# Altium schematic sheet Sheet2_Inverter_GateDriver.SchDoc
size B; CompanyName: Microchip Technology Inc.; Organization: Microchip Technology; Address1: 2355 West Chandler Blvd.; Address2: Chandler, AZ  85224; Address4: USA; DocumentNumber: 2; SheetNumber: 2; SheetTotal: 5; SheetTitle: Motor Control Inverter; Time: Time
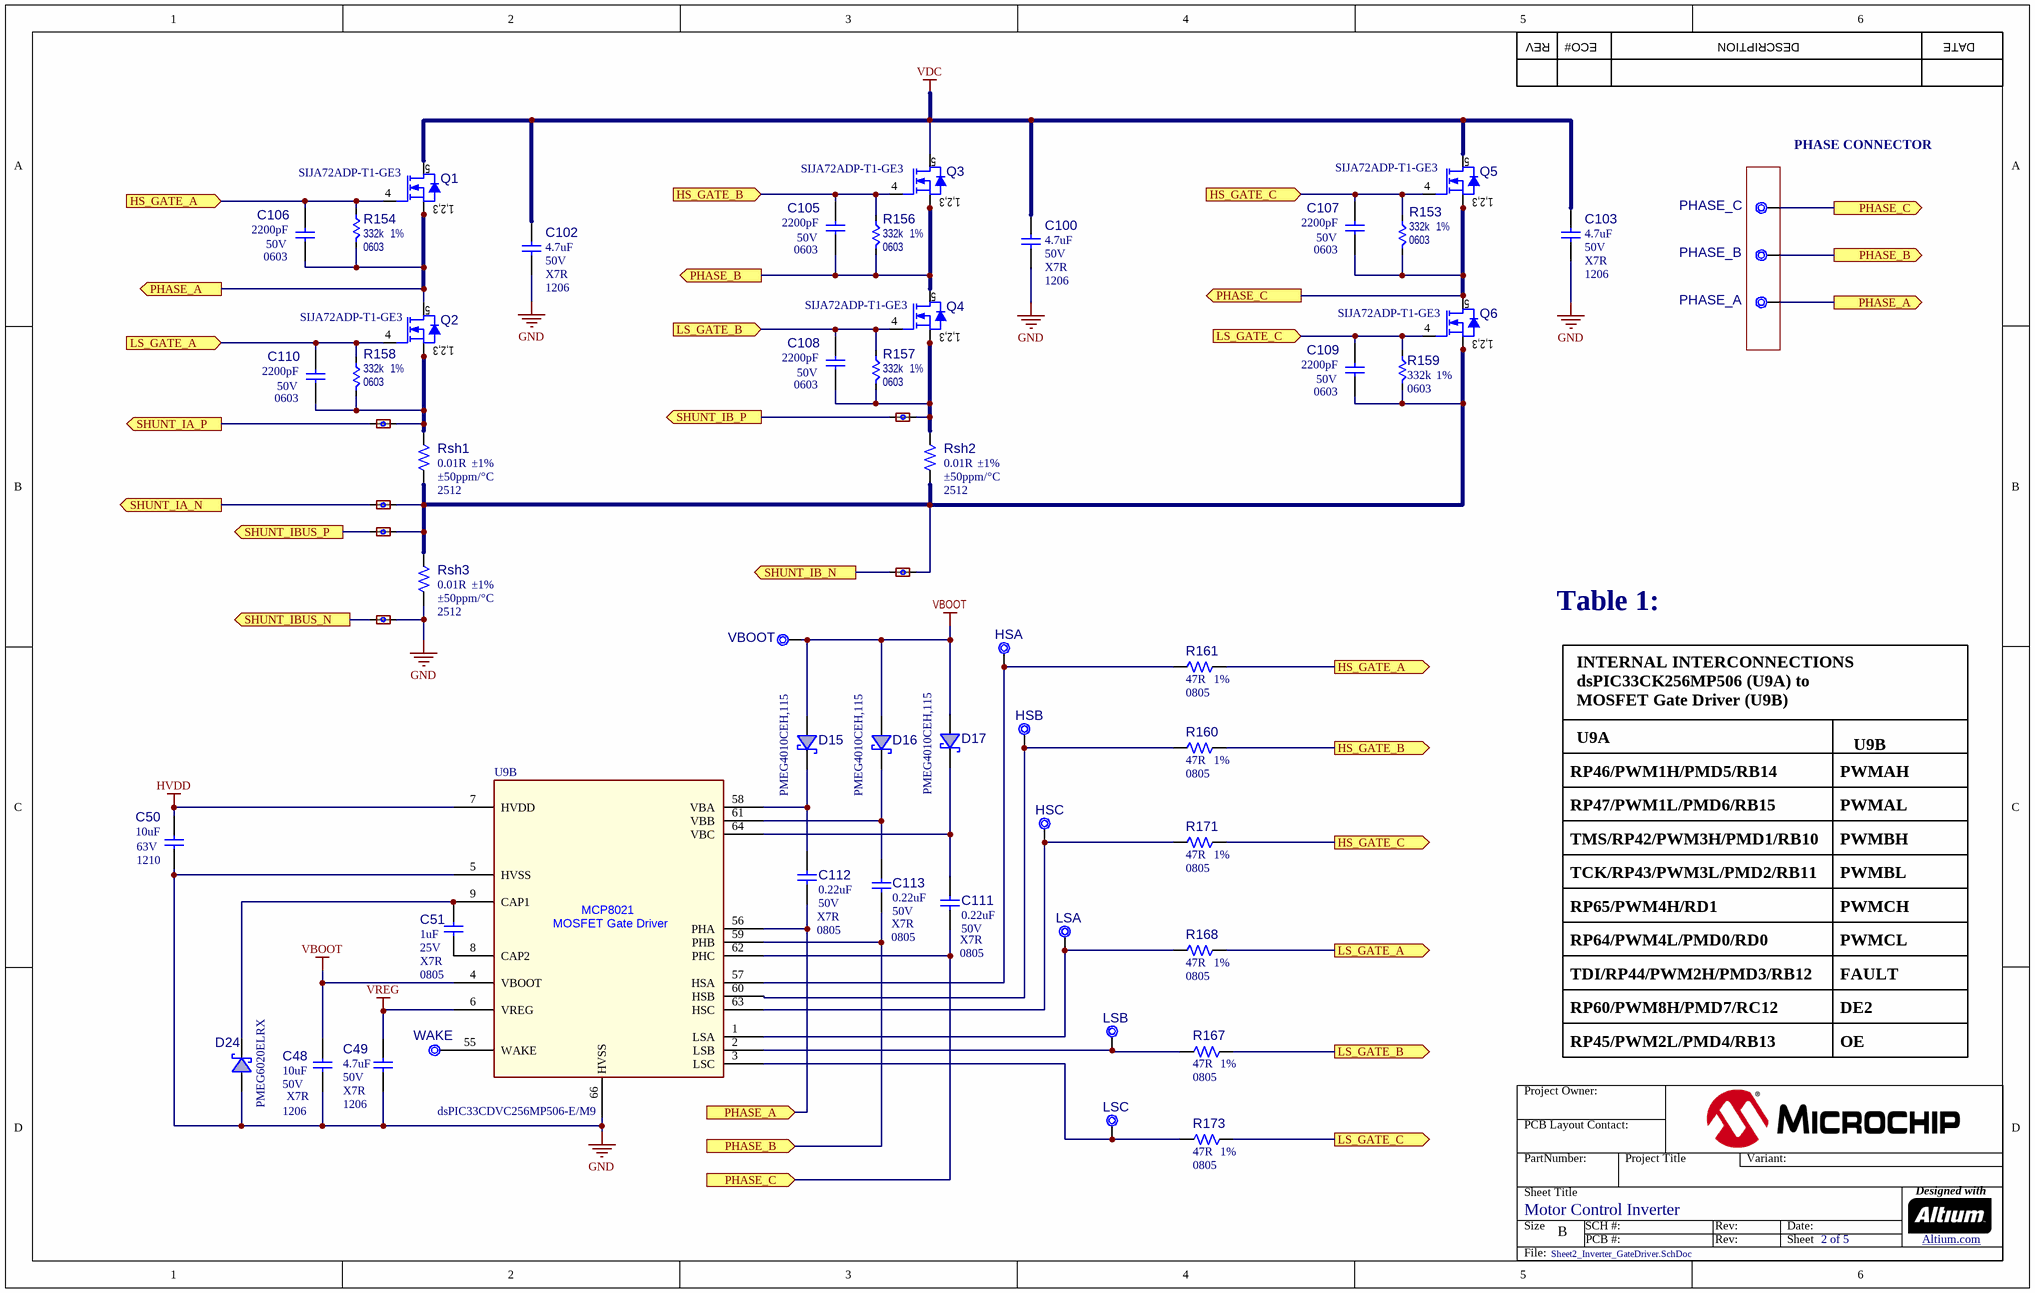
[diagram p0: Sheet2_Inverter_GateDriver.SchDoc]

## Parts
C48  value 10uF  Voltage: 50V  Package: 1206  Temperature Coefficient: X7R  [CAP_C_1206]  (hidden comment: Capacitor NP)
C49  value 4.7uF  Voltage: 50V  Package: 1206  Temperature Coeffcient: X7R  [CAP_C_1206]  (hidden comment: Capacitor NP)
C50  value 10uF  Voltage: 63V  Package: 1210  [CAP_C_1210]  (hidden comment: Capacitor NP)
C51  value 1uF  Voltage: 25V  Package: 0805  Temperature Coeffcient: X7R  [CAP_C_0805]  (hidden comment: Capacitor NP)
C100  value 4.7uF  Voltage: 50V  Package: 1206  Temperature Coeffcient: X7R  [CAP_C_1206]  (hidden comment: Capacitor NP)
C102  value 4.7uF  Voltage: 50V  Package: 1206  Temperature Coeffcient: X7R  [CAP_C_1206]  (hidden comment: Capacitor NP)
C103  value 4.7uF  Voltage: 50V  Package: 1206  Temperature Coeffcient: X7R  [CAP_C_1206]  (hidden comment: Capacitor NP)
C105  value 2200pF  Voltage: 50V  Package: 0603  [CAP_C_0603]  (hidden comment: Capacitor NP)
C106  value 2200pF  Voltage: 50V  Package: 0603  [CAP_C_0603]  (hidden comment: Capacitor NP)
C107  value 2200pF  Voltage: 50V  Package: 0603  [CAP_C_0603]  (hidden comment: Capacitor NP)
C108  value 2200pF  Voltage: 50V  Package: 0603  [CAP_C_0603]  (hidden comment: Capacitor NP)
C109  value 2200pF  Voltage: 50V  Package: 0603  [CAP_C_0603]  (hidden comment: Capacitor NP)
C110  value 2200pF  Voltage: 50V  Package: 0603  [CAP_C_0603]  (hidden comment: Capacitor NP)
C111  value 0.22uF  Voltage: 50V  Package: 0805  Temperature Coeffcient: X7R  [CAP_C_0805]  (hidden comment: Capacitor NP)
C112  value 0.22uF  Voltage: 50V  Package: 0805  Temperature Coeffcient: X7R  [CAP_C_0805]  (hidden comment: Capacitor NP)
C113  value 0.22uF  Voltage: 50V  Package: 0805  Temperature Coeffcient: X7R  [CAP_C_0805]  (hidden comment: Capacitor NP)
D15  value PMEG4010CEH,115  [SOD-123]  (hidden comment: Diode Schottky)
D16  value PMEG4010CEH,115  [SOD-123]  (hidden comment: Diode Schottky)
D17  value PMEG4010CEH,115  [SOD-123]  (hidden comment: Diode Schottky)
D24  value PMEG6020ELRX  [SOD-123W]  (hidden comment: Diode Schottky)
HSA  Test Point No BOM  [TP_TH_0.7PADX0.4HOLE]  (value not drawn)  (no BOM)
HSB  Test Point No BOM  [TP_TH_0.7PADX0.4HOLE]  (value not drawn)  (no BOM)
HSC  Test Point No BOM  [TP_TH_0.7PADX0.4HOLE]  (value not drawn)  (no BOM)
LSA  Test Point No BOM  [TP_TH_0.7PADX0.4HOLE]  (value not drawn)  (no BOM)
LSB  Test Point No BOM  [TP_TH_0.7PADX0.4HOLE]  (value not drawn)  (no BOM)
LSC  Test Point No BOM  [TP_TH_0.7PADX0.4HOLE]  (value not drawn)  (no BOM)
NT1  Net Tie  [NET_TIE_0.2mmx0.5mm]  (value not drawn)  (net tie, no BOM)
NT2  Net Tie  [NET_TIE_0.2mmx0.5mm]  (value not drawn)  (net tie, no BOM)
NT3  Net Tie  [NET_TIE_0.2mmx0.5mm]  (value not drawn)  (net tie, no BOM)
NT4  Net Tie  [NET_TIE_0.2mmx0.5mm]  (value not drawn)  (net tie, no BOM)
NT5  Net Tie  [NET_TIE_0.2mmx0.5mm]  (value not drawn)  (net tie, no BOM)
NT6  Net Tie  [NET_TIE_0.2mmx0.5mm]  (value not drawn)  (net tie, no BOM)
PHASE_A  Test Point No BOM  [TP_3.0X2.3X1.3HOLE]  (value not drawn)  (no BOM)
PHASE_B  Test Point No BOM  [TP_3.0X2.3X1.3HOLE]  (value not drawn)  (no BOM)
PHASE_C  Test Point No BOM  [TP_3.0X2.3X1.3HOLE]  (value not drawn)  (no BOM)
Q1  value SIJA72ADP-T1-GE3  [PPAK_SO-8L]  (hidden comment: Transistor MOS-N SSSGD)
Q2  value SIJA72ADP-T1-GE3  [PPAK_SO-8L]  (hidden comment: Transistor MOS-N SSSGD)
Q3  value SIJA72ADP-T1-GE3  [PPAK_SO-8L]  (hidden comment: Transistor MOS-N SSSGD)
Q4  value SIJA72ADP-T1-GE3  [PPAK_SO-8L]  (hidden comment: Transistor MOS-N SSSGD)
Q5  value SIJA72ADP-T1-GE3  [PPAK_SO-8L]  (hidden comment: Transistor MOS-N SSSGD)
Q6  value SIJA72ADP-T1-GE3  [PPAK_SO-8L]  (hidden comment: Transistor MOS-N SSSGD)
R153  value 332k  Package: 0603  Tolerance: 1%  [RES_C_0603]  (hidden comment: Resistor)
R154  value 332k  Package: 0603  Tolerance: 1%  [RES_C_0603]  (hidden comment: Resistor)
R156  value 332k  Package: 0603  Tolerance: 1%  [RES_C_0603]  (hidden comment: Resistor)
R157  value 332k  Package: 0603  Tolerance: 1%  [RES_C_0603]  (hidden comment: Resistor)
R158  value 332k  Package: 0603  Tolerance: 1%  [RES_C_0603]  (hidden comment: Resistor)
R159  value 332k  Package: 0603  Tolerance: 1%  [RES_C_0603]  (hidden comment: Resistor)
R160  value 47R  Package: 0805  Tolerance: 1%  [RES_C_0805]  (hidden comment: Resistor)
R161  value 47R  Package: 0805  Tolerance: 1%  [RES_C_0805]  (hidden comment: Resistor)
R167  value 47R  Package: 0805  Tolerance: 1%  [RES_C_0805]  (hidden comment: Resistor)
R168  value 47R  Package: 0805  Tolerance: 1%  [RES_C_0805]  (hidden comment: Resistor)
R171  value 47R  Package: 0805  Tolerance: 1%  [RES_C_0805]  (hidden comment: Resistor)
R173  value 47R  Package: 0805  Tolerance: 1%  [RES_C_0805]  (hidden comment: Resistor)
Rsh1  value 0.01R  Package: 2512  Tolerance: ±1%  Temperature Coeffcient: ±50ppm/°C  [RES_C_2512]  (hidden comment: Resistor)
Rsh2  value 0.01R  Package: 2512  Tolerance: ±1%  Temperature Coeffcient: ±50ppm/°C  [RES_C_2512]  (hidden comment: Resistor)
Rsh3  value 0.01R  Package: 2512  Tolerance: ±1%  Temperature Coeffcient: ±50ppm/°C  [RES_C_2512]  (hidden comment: Resistor)
U9  value dsPIC33CDVC256MP506-E/M9  [QFN-64_9X9_3EP_M9]  (hidden comment: dsPIC33CDVC256MP506_VGQFN-64)  (part B of 3)
VBOOT  Test Point No BOM  [TP_TH_0.7PADX0.4HOLE]  (value not drawn)  (no BOM)
WAKE  Test Point No BOM  [CON_TP_SMD_D25mil_NoSilk]  (value not drawn)  (no BOM)

## Ports
HS_GATE_A (in), HS_GATE_A (out), HS_GATE_B (in), HS_GATE_B (out), HS_GATE_C (in), HS_GATE_C (out), LS_GATE_A (in), LS_GATE_A (out), LS_GATE_B (in), LS_GATE_B (out), LS_GATE_C (in), LS_GATE_C (out), PHASE_A (in), PHASE_A (out), PHASE_B (in), PHASE_B (out), PHASE_C (in), PHASE_C (out), SHUNT_IA_N (out), SHUNT_IA_P (out), SHUNT_IB_N (out), SHUNT_IB_P (out), SHUNT_IBUS_N (out), SHUNT_IBUS_P (out)

## Nets
GND: C48.2 C49.2 C50.1 C100.2 C102.2 C103.2 D24.1(A) NT6.2 Rsh3.1 U9.5(HVSS) U9.66(HVSS)
HVDD: C50.2 U9.7(HVDD)
VBOOT: C48.1 D15.1(A) D16.1(A) D17.1(A) U9.4(VBOOT) VBOOT.1
VDC: C100.1 C102.1 C103.1 Q1.5(D) Q3.5(D) Q5.5(D)
VREG: C49.1 U9.6(VREG)
HS_GATE_A: C106.2 Q1.4(G) R154.1 R161.2 ; port HS_GATE_A
HS_GATE_B: C105.2 Q3.4(G) R156.1 R160.2 ; port HS_GATE_B
HS_GATE_C: C107.2 Q5.4(G) R153.1 R171.2 ; port HS_GATE_C
LS_GATE_A: C110.2 Q2.4(G) R158.1 R168.2 ; port LS_GATE_A
LS_GATE_B: C108.2 Q4.4(G) R157.1 R167.2 ; port LS_GATE_B
LS_GATE_C: C109.2 Q6.4(G) R159.1 R173.2 ; port LS_GATE_C
PHASE_A: C106.1 C112.1 PHASE_A.1 Q1.1(S) Q1.2(S) Q1.3(S) Q2.5(D) R154.2 U9.56(PHA) ; port PHASE_A
PHASE_B: C105.1 C113.1 PHASE_B.1 Q3.1(S) Q3.2(S) Q3.3(S) Q4.5(D) R156.2 U9.59(PHB) ; port PHASE_B
PHASE_C: C107.1 C111.1 PHASE_C.1 Q5.1(S) Q5.2(S) Q5.3(S) Q6.5(D) R153.2 U9.62(PHC) ; port PHASE_C
SHUNT_IA_N: NT3.1 ; port SHUNT_IA_N
SHUNT_IA_P: NT2.1 ; port SHUNT_IA_P
SHUNT_IB_N: NT5.1 ; port SHUNT_IB_N
SHUNT_IB_P: NT1.1 ; port SHUNT_IB_P
SHUNT_IBUS_N: NT6.1 ; port SHUNT_IBUS_N
SHUNT_IBUS_P: NT4.1 ; port SHUNT_IBUS_P
NetC51_1: C51.1 U9.8(CAP2)
NetC51_2: C51.2 D24.2(K) U9.9(CAP1)
NetC108_1: C108.1 NT1.2 Q4.1(S) Q4.2(S) Q4.3(S) R157.2 Rsh2.2
NetC109_1: C109.1 NT3.2 NT4.2 NT5.2 Q6.1(S) Q6.2(S) Q6.3(S) R159.2 Rsh1.1 Rsh2.1 Rsh3.2
NetC110_1: C110.1 NT2.2 Q2.1(S) Q2.2(S) Q2.3(S) R158.2 Rsh1.2
NetC111_2: C111.2 D17.2(K) U9.64(VBC)
NetC112_2: C112.2 D15.2(K) U9.58(VBA)
NetC113_2: C113.2 D16.2(K) U9.61(VBB)
NetHSA_1: HSA.1 R161.1 U9.57(HSA)
NetHSB_1: HSB.1 R160.1 U9.60(HSB)
NetHSC_1: HSC.1 R171.1 U9.63(HSC)
NetLSA_1: LSA.1 R168.1 U9.1(LSA)
NetLSB_1: LSB.1 R167.1 U9.2(LSB)
NetLSC_1: LSC.1 R173.1 U9.3(LSC)
NetU9_55: U9.55(WAKE) WAKE.1

## Notes on the sheet
- REV
- ECO#
- DESCRIPTION
- DATE
- PHASE CONNECTOR
- Table 1:
- INTERNAL INTERCONNECTIONS dsPIC33CK256MP506 (U9A) to
  MOSFET Gate Driver (U9B)
- U9A
- PWMAH
- U9B
- RP46/PWM1H/PMD5/RB14
- RP47/PWM1L/PMD6/RB15
- TMS/RP42/PWM3H/PMD1/RB10
- PWMAL
- PWMBH
- TCK/RP43/PWM3L/PMD2/RB11
- RP65/PWM4H/RD1
- PWMBL
- PWMCH
- RP64/PWM4L/PMD0/RD0
- TDI/RP44/PWM2H/PMD3/RB12
- PWMCL
- FAULT
- RP60/PWM8H/PMD7/RC12
- RP45/PWM2L/PMD4/RB13
- DE2
- OE
- Project Owner:
- PCB Layout Contact:
- PartNumber:
- Project Title
- Variant:
- Sheet Title
- Size
- B
- SCH #:
- PCB #:
- Rev:
- Date:
- Sheet
- Designed with
- Altium.com <http://go.altium.com/MicrochipLandingPage_Evaluation.html>
- File:
- (in symbol MIC9437, part B) MCP8021; MOSFET Gate Driver
- (in symbol TRA1519) 1,2,3

## Library data of the parts
C48 = CAP2232: Manufacturer 1: TDK Corporation; Manufacturer Part Number 1: CGA5L1X7R1H106K160AC; Description_: CAP CER 10uF 50V 10% X7R SMD 1206 AEC-Q200; Dev Tools Status: Production; Type: Ceramic; Owner: Sam Charles; Populated: YES; Restricted Sourcing: No; MCHP-ID: CAP2232; Revision: 2; Symbol: Capacitor NP; Status: MCL Design; ComponentLink1URL: https://chn-vm-apps.microchip.com/mchprepo/parts/Datasheets/mlcc_automotive_general_en.pdf; ComponentLink1Description: SVN Datasheet; ComponentLink2URL: C:\ALTIUM_WORK\00001_MCHP-CDB\Datasheets\mlcc_automotive_general_en.pdf; ComponentLink2Description: Local Datasheet; ComponentLink3URL: C:\ALTIUM_WORK\00001_MCHP-CDB\Library\LibraryRefs\Capacitor NP.SchLib; ComponentLink3Description: Open Symbol; ComponentLink4URL: C:\ALTIUM_WORK\00001_MCHP-CDB\Library\Footprints\CAP_C_1206.PcbLib; ComponentLink4Description: Open Footprint; ComponentLink5Description: Open Footprint 2; ComponentLink6Description: Open Footprint 3; ComponentLink7Description: Open Footprint 4; Operating Temperature: -55°C ~ 125°C; Category: Capacitor; Supplier 1: Digi-Key; Supplier Part Number 1: 445-180362-1-ND; Quantity Override: 1
C49 C100 C102 C103 = CAP1292: Capacitor; Manufacturer 1: TDK Corporation; Manufacturer Part Number 1: C3216X7R1H475K160AC; Description_: CAP CER 4.7uF 50V 10% X7R SMD 1206; Dev Tools Status: Production; Tolerance: 10%; Type: Ceramic; Owner: Jairuz Agang-ang; Populated: YES; MCHP-ID: CAP1292; Revision: 1; Symbol: Capacitor NP; Status: MCL Design; ComponentLink1URL: https://chn-vm-apps.microchip.com/mchprepo/parts/Datasheets/mlcc_commercial_general_en.pdf; ComponentLink1Description: SVN Datasheet; ComponentLink2URL: C:\ALTIUM_WORK\00001_MCHP-CDB\Datasheets\mlcc_commercial_general_en.pdf; ComponentLink2Description: Local Datasheet; ComponentLink3URL: C:\ALTIUM_WORK\00001_MCHP-CDB\Library\LibraryRefs\Capacitor NP.SchLib; ComponentLink3Description: Open Symbol; ComponentLink4URL: C:\ALTIUM_WORK\00001_MCHP-CDB\Library\Footprints\CAP_C_1206.PcbLib; ComponentLink4Description: Open Footprint; ComponentLink5Description: Open Footprint 2; ComponentLink6Description: Open Footprint 3; ComponentLink7Description: Open Footprint 4; Operating Temperature: -55C to +125C; Category: Capacitor; Supplier 1: Digi-Key; Supplier Part Number 1: 445-8032-1-ND; Quantity Override: 1
C50 = CAP2578: Manufacturer 1: Samsung Electro-Mechanics; Manufacturer Part Number 1: CL32B106KMVNNWE; Description_: CAP CER 10uF 63V 10% X7R SMD 1210; Dev Tools Status: Design; Tolerance: 10%; Temperature Coefficient: X7R; Type: Ceramic; Owner: Narasimha Murthy; Populated: YES; MCHP-ID: CAP2578; Revision: 1; Symbol: Capacitor NP; Status: MCL Design; ComponentLink1URL: https://chn-vm-apps.microchip.com/mchprepo/parts/Datasheets/CL32B106KMVNNWE_Spec.pdf; ComponentLink1Description: SVN Datasheet; ComponentLink2URL: C:\ALTIUM_WORK\00001_MCHP-CDB\Datasheets\CL32B106KMVNNWE_Spec.pdf; ComponentLink2Description: Local Datasheet; ComponentLink3URL: C:\ALTIUM_WORK\00001_MCHP-CDB\Library\LibraryRefs\Capacitor NP.SchLib; ComponentLink3Description: Open Symbol; ComponentLink4URL: C:\ALTIUM_WORK\00001_MCHP-CDB\Library\Footprints\CAP_C_1210.PcbLib; ComponentLink4Description: Open Footprint; ComponentLink5Description: Open Footprint 2; ComponentLink6Description: Open Footprint 3; ComponentLink7Description: Open Footprint 4; Operating Temperature: -55C to +125C; Category: Capacitor; Supplier 1: Digi-Key; Supplier Part Number 1: 1276-7053-1-ND; Quantity Override: 1
C51 = CAP1211: Capacitor; Manufacturer 1: AVX; Manufacturer Part Number 1: 08053C105K4Z2A; Description_: CAP CER 1uF 25V 10% X7R SMD 0805; Dev Tools Status: Production; Tolerance: 10%; Type: Ceramic; Owner: Tad Ahlvers; Populated: YES; MCHP-ID: CAP1211; Revision: 1; Symbol: Capacitor NP; Status: MCL Design; ComponentLink1URL: https://chn-vm-apps.microchip.com/mchprepo/parts/Datasheets/flexiterm.pdf; ComponentLink1Description: SVN Datasheet; ComponentLink2URL: C:\ALTIUM_WORK\00001_MCHP-CDB\Datasheets\flexiterm.pdf; ComponentLink2Description: Local Datasheet; ComponentLink3URL: C:\ALTIUM_WORK\00001_MCHP-CDB\Library\LibraryRefs\Capacitor NP.SchLib; ComponentLink3Description: Open Symbol; ComponentLink4URL: C:\ALTIUM_WORK\00001_MCHP-CDB\Library\Footprints\CAP_C_0805.PcbLib; ComponentLink4Description: Open Footprint; ComponentLink5Description: Open Footprint 2; ComponentLink6Description: Open Footprint 3; ComponentLink7Description: Open Footprint 4; Operating Temperature: -55C to +125C; Category: Capacitor; Manufacturer 2: KEMET; Manufacturer Part Number 2: C0805C105K3RACTU; Manufacturer 3: TDK Corporation; Manufacturer Part Number 3: C2012X7R1E105K125AB; Supplier 1: Digi-Key; Supplier Part Number 1: 478-6357-2-ND; Supplier 2: Digi-Key; Supplier Part Number 2: C0805C105K3RACTU-ND; Supplier 3: Digi-Key; Supplier Part Number 3: 445-1354-1-ND; Quantity Override: 1
C105-C110 = CAP0120: Manufacturer 1: KEMET; Manufacturer Part Number 1: C0603C222K5RACTU; Description_: CAP CER 2200pF 50V 10% X7R SMD 0603; Dev Tools Status: Production; Tolerance: 10%; Temperature Coefficient: X7R; Type: Ceramic; Populated: Yes; MCHP-ID: CAP0120; Revision: 4; Symbol: Capacitor NP; Status: MCL Design; ComponentLink1URL: https://chn-vm-apps.microchip.com/mchprepo/parts/Datasheets/ECJ__General_.pdf; ComponentLink1Description: SVN Datasheet; ComponentLink2URL: C:\ALTIUM_WORK\00001_MCHP-CDB\Datasheets\ECJ__General_.pdf; ComponentLink2Description: Local Datasheet; ComponentLink3URL: C:\ALTIUM_WORK\00001_MCHP-CDB\Library\LibraryRefs\Capacitor NP.SchLib; ComponentLink3Description: Open Symbol; ComponentLink4URL: C:\ALTIUM_WORK\00001_MCHP-CDB\Library\Footprints\CAP_C_0603.PcbLib; ComponentLink4Description: Open Footprint; ComponentLink5Description: Open Footprint 2; ComponentLink6Description: Open Footprint 3; ComponentLink7Description: Open Footprint 4; Operating Temperature: -55C to +125C; Category: Capacitor; Manufacturer 2: Panasonic; Manufacturer Part Number 2: ECJ-1VB1H222K; Manufacturer 3: Panasonic; Manufacturer Part Number 3: ECU-V1H222KBV; Manufacturer 4: TDK Corporation; Manufacturer Part Number 4: C1608X7R1H222K; Manufacturer 5: Samsung Electro-Mechanics; Manufacturer Part Number 5: CL10B222KB8NNNC; Manufacturer 6: Yageo; Manufacturer Part Number 6: CC0603KRX7R9BB222; Supplier 1: Digi-Key; Supplier Part Number 1: 399-1085-1-ND; Supplier 2: Digi-Key; Supplier Part Number 2: PCC1776TR-ND; Supplier 3: Digi-Key; Supplier Part Number 3: PCC222BVTR-ND; Supplier 4: Digi-Key; Supplier Part Number 4: 445-1309-1-ND; Supplier 5: Samsung Electro-Mechanics; Supplier Part Number 5: CL10B222KB8NNNC; Supplier 6: Yageo; Supplier Part Number 6: CC0603KRX7R9BB222; Quantity Override: 1
C111-C113 = CAP0526: Capacitor; Manufacturer 1: Murata; Manufacturer Part Number 1: GCM21BR71H224KA37L; Description_: CAP CER 0.22uF 50V 10% X7R SMD 0805; Dev Tools Status: Production; Tolerance: 10%; Type: Ceramic; Populated: Yes; MCHP-ID: CAP0526; Revision: 1; Symbol: Capacitor NP; Status: MCL Design; ComponentLink1URL: https://chn-vm-apps.microchip.com/mchprepo/parts/Datasheets/S0717E.pdf; ComponentLink1Description: SVN Datasheet; ComponentLink2URL: C:\ALTIUM_WORK\00001_MCHP-CDB\Datasheets\S0717E.pdf; ComponentLink2Description: Local Datasheet; ComponentLink3URL: C:\ALTIUM_WORK\00001_MCHP-CDB\Library\LibraryRefs\Capacitor NP.SchLib; ComponentLink3Description: Open Symbol; ComponentLink4URL: C:\ALTIUM_WORK\00001_MCHP-CDB\Library\Footprints\CAP_C_0805.PcbLib; ComponentLink4Description: Open Footprint; ComponentLink5Description: Open Footprint 2; ComponentLink6Description: Open Footprint 3; ComponentLink7Description: Open Footprint 4; Operating Temperature: -55C to +125C; Category: Capacitor; Supplier 1: Digi-Key; Supplier Part Number 1: 490-4970-1-ND; Quantity Override: 1
D15-D17 = DIODE1743: Manufacturer 1: Nexperia USA Inc.; Description_: DIO SCTKY PMEG4010CEH,115 40V 1A SOD-123F; Dev Tools Status: Design; Type: Schottky Single; Forward Current: 1A; Reverse Current: 50µA; Reverse Voltage: 40V; Owner: Narasimha Murthy; Populated: YES; MCHP-ID: DIODE1743; Revision: 1; Symbol: Diode Schottky; Status: MCL Design; Package: SOD-123; ComponentLink1URL: https://chn-vm-apps.microchip.com/mchprepo/parts/Datasheets/PMEG4010CEH_PMEG4010CEJ.pdf; ComponentLink1Description: SVN Datasheet; ComponentLink2URL: C:\ALTIUM_WORK\00001_MCHP-CDB\Datasheets\PMEG4010CEH_PMEG4010CEJ.pdf; ComponentLink2Description: Local Datasheet; ComponentLink3URL: C:\ALTIUM_WORK\00001_MCHP-CDB\Library\LibraryRefs\Diode Schottky.SchLib; ComponentLink3Description: Open Symbol; ComponentLink4URL: C:\ALTIUM_WORK\00001_MCHP-CDB\Library\Footprints\SOD-123.PcbLib; ComponentLink4Description: Open Footprint; ComponentLink5Description: Open Footprint 2; ComponentLink6Description: Open Footprint 3; ComponentLink7Description: Open Footprint 4; Category: Diode; Manufacturer Part Number 1: PMEG4010CEH,115; Supplier 1: Digi-Key; Supplier Part Number 1: 1727-3846-1-ND; Quantity Override: 1
D24 = DIODE1801: Manufacturer 1: Nexperia USA Inc.; Description_: DIO SCTKY PMEG6020ELRX 760mV 2A 60V SMD SOD-123W; Dev Tools Status: Design; Type: Rectifier Single; Forward Current: 2A; Reverse Current: 150uA; Reverse Recovery Time: <500ns; Reverse Voltage: 60V; Owner: Narasimha Murthy; Populated: YES; MCHP-ID: DIODE1801; Revision: 1; Symbol: Diode Schottky; Status: MCL Design; Package: SOD-123W; ComponentLink1URL: https://chn-vm-apps.microchip.com/mchprepo/parts/Datasheets/PMEG6020ELR.pdf; ComponentLink1Description: SVN Datasheet; ComponentLink2URL: C:\ALTIUM_WORK\00001_MCHP-CDB\Datasheets\PMEG6020ELR.pdf; ComponentLink2Description: Local Datasheet; ComponentLink3URL: C:\ALTIUM_WORK\00001_MCHP-CDB\Library\LibraryRefs\Diode Schottky.SchLib; ComponentLink3Description: Open Symbol; ComponentLink4URL: C:\ALTIUM_WORK\00001_MCHP-CDB\Library\Footprints\SOD-123W.PcbLib; ComponentLink4Description: Open Footprint; ComponentLink5Description: Open Footprint 2; ComponentLink6Description: Open Footprint 3; ComponentLink7Description: Open Footprint 4; Operating Temperature: -55C to +175C; Category: Diode; Manufacturer Part Number 1: PMEG6020ELRX; Supplier 1: Digi-Key; Supplier Part Number 1: 1727-2298-1-ND; Quantity Override: 1
HSA HSB HSC LSA LSB LSC = CON2938: Test Point; Description_: CON TP PAD PCB TH D0.7H0.4; Dev Tools Status: Design; Owner: Severino Balong Jr.; Populated: DNP; MCHP-ID: CON2938; Revision: 1; Symbol: Test Point No BOM; Status: MCL Design; ComponentLink1Description: SVN Datasheet; ComponentLink2Description: Local Datasheet; ComponentLink3URL: C:\ALTIUM_WORK\00001_MCHP-CDB\Library\LibraryRefs\Test Point No BOM.SchLib; ComponentLink3Description: Open Symbol; ComponentLink4URL: C:\ALTIUM_WORK\00001_MCHP-CDB\Library\Footprints\TP_TH_0.7PADX0.4HOLE.PcbLib; ComponentLink4Description: Open Footprint; ComponentLink5Description: Open Footprint 2; ComponentLink6Description: Open Footprint 3; ComponentLink7Description: Open Footprint 4; Type: Test Point No BOM; Category: Connector; Quantity Override: 1; Assembly Type: TH; Restricted Sourcing: No
NT1-NT6 = RES2817: Description_: RES Net Tie SMD Net Tie 0.2mm; Dev Tools Status: Design; Owner: Cristina Salanti; Populated: DNP; Restricted Sourcing: No; MCHP-ID: RES2817; Value: Net Tie; Package: 0.2mm; Revision: A; Symbol: Net Tie; Status: MCL Design; ComponentLink1Description: SVN Datasheet; ComponentLink2Description: Local Datasheet; ComponentLink3URL: C:\ALTIUM_WORK\00001_MCHP-CDB\Library\LibraryRefs\Net Tie.SchLib; ComponentLink3Description: Open Symbol; ComponentLink4URL: C:\ALTIUM_WORK\00001_MCHP-CDB\Library\Footprints\NET_TIE_0.2mmx0.5mm.PcbLib; ComponentLink4Description: Open Footprint; ComponentLink5Description: Open Footprint 2; ComponentLink6Description: Open Footprint 3; ComponentLink7Description: Open Footprint 4; Category: Resistor; Type: RES SMD; Quantity Override: 1
PHASE_A PHASE_B PHASE_C = CON2948: Test Point; Value: TP 3.0mm x 2.3mm PAD 1.3mm HOLE; Description_: CON TP PAD PCB TH 3.0x2.3mm PAD 1.3mm HOLE; Dev Tools Status: Design; Owner: Severino Balong Jr.; Populated: DNP; MCHP-ID: CON2948; Revision: 1; Symbol: Test Point No Bom; Status: MCL Design; ComponentLink1Description: SVN Datasheet; ComponentLink2Description: Local Datasheet; ComponentLink3URL: C:\ALTIUM_WORK\00001_MCHP-CDB\Library\LibraryRefs\Test Point No Bom.SchLib; ComponentLink3Description: Open Symbol; ComponentLink4URL: C:\ALTIUM_WORK\00001_MCHP-CDB\Library\Footprints\TP_3.0X2.3X1.3HOLE.PcbLib; ComponentLink4Description: Open Footprint; ComponentLink5Description: Open Footprint 2; ComponentLink6Description: Open Footprint 3; ComponentLink7Description: Open Footprint 4; Type: Test Point No BOM; Category: Connector; Quantity Override: 1; Assembly Type: TH; Restricted Sourcing: No
Q1-Q6 = TRA1519: Transistor MOS; Manufacturer 1: Vishay; Description_: TRANS FET N-CH SIJA72ADP-T1-GE3 40V 27.9A 4.8W PowerPAK SO-8L AEC-Q101; Dev Tools Status: Production; Type: FET; Current: 27.9A; Drain to Source Voltage: 40V; Gate to Source Voltage: 20V; Power: 4.8W; Owner: Cristina Salanti; Populated: YES; Restricted Sourcing: No; MCHP-ID: TRA1519; Revision: 2; Symbol: Transistor MOS-N SSSGD; Status: MCL Design; Package: PowerPAK SO-8L; ComponentLink1URL: https://chn-vm-apps.microchip.com/mchprepo/parts/Datasheets/sija72adp.pdf; ComponentLink1Description: SVN Datasheet; ComponentLink2URL: C:\ALTIUM_WORK\00001_MCHP-CDB\Datasheets\sija72adp.pdf; ComponentLink2Description: Local Datasheet; ComponentLink3URL: C:\ALTIUM_WORK\00001_MCHP-CDB\Library\LibraryRefs\Transistor MOS-N SSSGD.SchLib; ComponentLink3Description: Open Symbol; ComponentLink4URL: C:\ALTIUM_WORK\00001_MCHP-CDB\Library\Footprints\PPAK_SO-8L.PcbLib; ComponentLink4Description: Open Footprint; ComponentLink5Description: Open Footprint 2; ComponentLink6Description: Open Footprint 3; ComponentLink7Description: Open Footprint 4; Operating Temperature: -55C to +150C; Category: Transistor; Voltage: 40V; Manufacturer Part Number 1: SIJA72ADP-T1-GE3; Supplier 1: Digi-Key; Supplier Part Number 1: SIJA72ADP-T1-GE3CT-ND; Quantity Override: 1
R153 R154 R156-R159 = RES1168: Manufacturer 1: Panasonic; Manufacturer Part Number 1: ERJ-3EKF3323V; Description_: RES TKF 332k 1% 1/10W SMD 0603; Voltage: 75V; Temperature Coeffcient: 100ppm/C; Power: 1/10W; Owner: Bogdan P (M91398); Populated: Yes; MCHP-ID: RES1168; Revision: 0; Status: Production; ComponentLink1URL: https://chn-vm-apps.microchip.com/mchprepo/parts/Datasheets/AOA0000CE2.pdf; ComponentLink1Description: Datasheet; Operating Temperature: -55C to +155C; Category: Resistor; Type: RES SMD; Composition: TKF; Supplier 1: Digi-Key; Supplier Part Number 1: P332KHCT-ND; Quantity Override: 1
R160 R161 R167 R168 R171 R173 = RES1422: Manufacturer 1: Yageo; Manufacturer Part Number 1: RC0805FR-0747RL; Description_: RES TKF 47R 1% 1/8W SMD 0805; Dev Tools Status: Production; Temperature Coeffcient: 100ppm/C; Power: 1/8W; Owner: Henry de Villiers; Populated: YES; MCHP-ID: RES1422; Revision: 1; Symbol: Resistor; Status: MCL Design; ComponentLink1URL: https://chn-vm-apps.microchip.com/mchprepo/parts/Datasheets/PYu-R_INT-thick_7.pdf; ComponentLink1Description: SVN Datasheet; ComponentLink2URL: C:\ALTIUM_WORK\00001_MCHP-CDB\Datasheets\PYu-R_INT-thick_7.pdf; ComponentLink2Description: Local Datasheet; ComponentLink3URL: C:\ALTIUM_WORK\00001_MCHP-CDB\Library\LibraryRefs\Resistor.SchLib; ComponentLink3Description: Open Symbol; ComponentLink4URL: C:\ALTIUM_WORK\00001_MCHP-CDB\Library\Footprints\RES_C_0805.PcbLib; ComponentLink4Description: Open Footprint; ComponentLink5Description: Open Footprint 2; ComponentLink6Description: Open Footprint 3; ComponentLink7Description: Open Footprint 4; Operating Temperature: -55C to +155C; Category: Resistor; Type: RES SMD; Composition: TKF; Supplier 1: Digi-Key; Supplier Part Number 1: 311-47.0CRCT-ND; Quantity Override: 1
Rsh1-Rsh3 = RES2263: Manufacturer 1: Bourns Inc.; Manufacturer Part Number 1: CRA2512-FZ-R010ELF; Description_: RES MF 0.01R 1% 3W SMD 2512 AEC-Q200; Dev Tools Status: Design; Power: 3W; Owner: Narasimha Murthy; Populated: YES; MCHP-ID: RES2263; Revision: A; Symbol: Resistor; Status: MCL Design; ComponentLink1URL: https://chn-vm-apps.microchip.com/mchprepo/parts/Datasheets/cra.pdf; ComponentLink1Description: SVN Datasheet; ComponentLink2URL: C:\ALTIUM_WORK\00001_MCHP-CDB\Datasheets\cra.pdf; ComponentLink2Description: Local Datasheet; ComponentLink3URL: C:\ALTIUM_WORK\00001_MCHP-CDB\Library\LibraryRefs\Resistor.SchLib; ComponentLink3Description: Open Symbol; ComponentLink4URL: C:\ALTIUM_WORK\00001_MCHP-CDB\Library\Footprints\RES_C_2512.PcbLib; ComponentLink4Description: Open Footprint; ComponentLink5Description: Open Footprint 2; ComponentLink6Description: Open Footprint 3; ComponentLink7Description: Open Footprint 4; Operating Temperature: -55°C ~ 170°C; Category: Resistor; Type: RES SMD; Composition: MF; Supplier 1: Digi-Key; Supplier Part Number 1: CRA2512-FZ-R010ELFCT-ND; Quantity Override: 1
U9 = MIC9437: Manufacturer 1: Microchip Technology; Description_: MCHP MCU 16-BIT 100MIPS 256kB 24kB dsPIC33CDVC256MP506-E/M9; Dev Tools Status: Design; Owner: Narasimha Murthy; Populated: YES; MCHP-ID: MIC9437; Symbol: dsPIC33CDVC256MP506_VGQFN-64; Type: 16-Bit; Status: MCL Design; Revision: 1; Category: MCHP-Microcontroller; ComponentLink1URL: https://www.microchip.com/sitesearch/search/Product%20and%20Development%20Tools/dsPIC33CDVC256MP506-E/M9; ComponentLink1Description: SVN Datasheet; ComponentLink2Description: Local Datasheet; ComponentLink3URL: C:\ALTIUM_WORK\00001_MCHP-CDB\Library\LibraryRefs\dsPIC33CDVC256MP506_VGQFN-64.SchLib; ComponentLink3Description: Open Symbol; ComponentLink4URL: C:\ALTIUM_WORK\00001_MCHP-CDB\Library\Footprints\QFN-64_9X9_3EP_M9.PcbLib; ComponentLink4Description: Open Footprint; ComponentLink5Description: Open Footprint 2; ComponentLink6Description: Open Footprint 3; ComponentLink7Description: Open Footprint 4; Manufacturer Part Number 1: dsPIC33CDVC256MP506-E/M9; Supplier 1: Microchip Technology; Supplier Part Number 1: dsPIC33CDVC256MP506-E/M9; Operating Temperature: -40C to +125C; Quantity Override: 1
VBOOT = CON2938: Test Point; Description_: CON TP PAD PCB TH D0.7H0.4; Owner: Severino Balong Jr.; Populated: DNP; Dev Tools Status: Design; MCHP-ID: CON2938; Revision: 1; Status: MCL Design; Category: Connector; Quantity Override: 1; ComponentLink1Description: SVN Datasheet; Type: Test Point No BOM; Symbol: Test Point No BOM; ComponentLink2Description: Local Datasheet; ComponentLink3URL: C:\ALTIUM_WORK\00001_MCHP-CDB\Library\LibraryRefs\Test Point No BOM.SchLib; ComponentLink3Description: Open Symbol; ComponentLink4URL: C:\ALTIUM_WORK\00001_MCHP-CDB\Library\Footprints\TP_TH_0.7PADX0.4HOLE.PcbLib; ComponentLink4Description: Open Footprint; ComponentLink5Description: Open Footprint 2; ComponentLink6Description: Open Footprint 3; ComponentLink7Description: Open Footprint 4; Assembly Type: TH; Restricted Sourcing: No
WAKE = CON3082: Test Point; Description_: CON TP PAD PCB SMD D25mil; Dev Tools Status: Design; Owner: James Boomer; Populated: YES; Value: TP SMD D25mil; MCHP-ID: CON3082; Revision: 1; Symbol: Test Point No BOM; Status: MCL Design; ComponentLink1Description: SVN Datasheet; ComponentLink2Description: Local Datasheet; ComponentLink3URL: C:\ALTIUM_WORK\00001_MCHP-CDB\Library\LibraryRefs\Test Point No BOM.SchLib; ComponentLink3Description: Open Symbol; ComponentLink4URL: C:\ALTIUM_WORK\00001_MCHP-CDB\Library\Footprints\CON_TP_SMD_D25mil_NoSilk.PcbLib; ComponentLink4Description: Open Footprint; ComponentLink5Description: Open Footprint 2; ComponentLink6Description: Open Footprint 3; ComponentLink7Description: Open Footprint 4; Type: Test Point No BOM; Category: Connector; Quantity Override: 1; Assembly Type: SMD; Restricted Sourcing: No